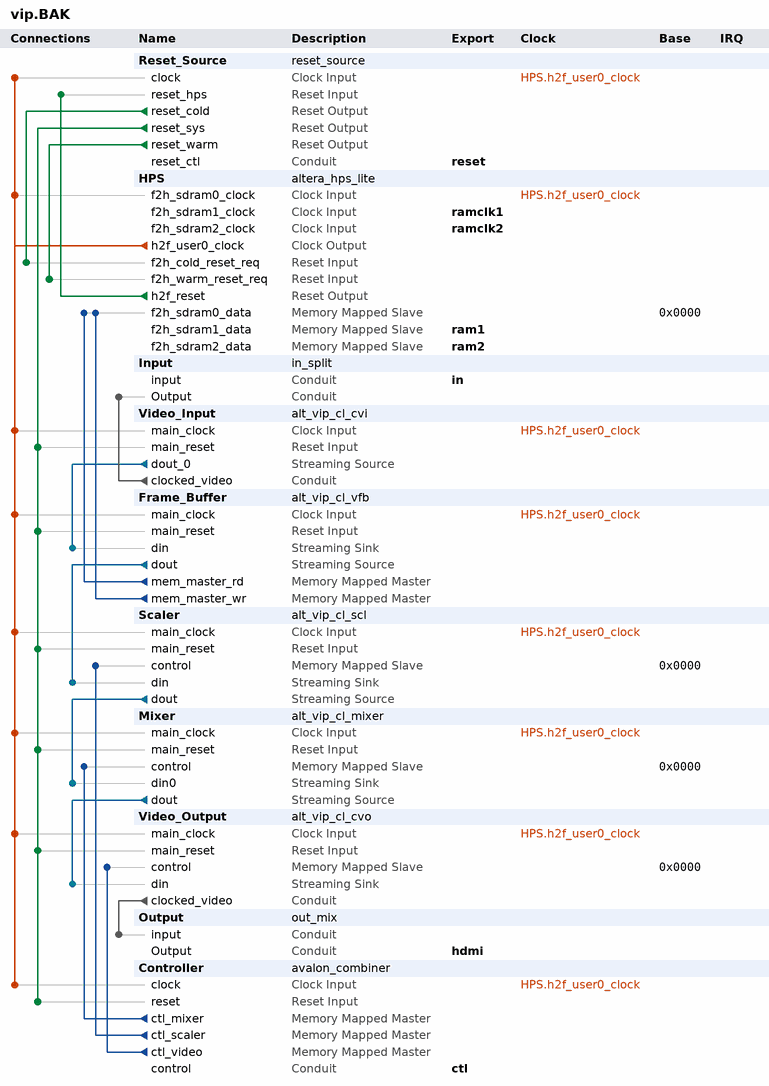
[diagram p0: system contents]
# Platform Designer (Qsys) system vip.BAK, Cyclone V 5CSEBA6U23I7
# Parameters at their usual value, and those the tool derives, are not listed.
package require -exact qsys 17.0
create_system vip.BAK
set_project_property DEVICE_FAMILY {Cyclone V}
set_project_property DEVICE 5CSEBA6U23I7

add_instance Reset_Source reset_source 17.0

add_instance HPS altera_hps_lite 17.0
set_instance_parameter_value HPS BONDING_OUT_ENABLED false
set_instance_parameter_value HPS BOOTFROMFPGA_Enable false
set_instance_parameter_value HPS BSEL 1
set_instance_parameter_value HPS BSEL_EN false
set_instance_parameter_value HPS CAN0_Mode N/A
set_instance_parameter_value HPS CAN0_PinMuxing Unused
set_instance_parameter_value HPS CAN1_Mode N/A
set_instance_parameter_value HPS CAN1_PinMuxing Unused
set_instance_parameter_value HPS CSEL 0
set_instance_parameter_value HPS CSEL_EN false
set_instance_parameter_value HPS CTI_Enable false
set_instance_parameter_value HPS DEBUGAPB_Enable false
set_instance_parameter_value HPS DMA_Enable No,No,No,No,No,No,No,No
set_instance_parameter_value HPS EMAC0_Mode N/A
set_instance_parameter_value HPS EMAC0_PTP false
set_instance_parameter_value HPS EMAC0_PinMuxing Unused
set_instance_parameter_value HPS EMAC1_Mode N/A
set_instance_parameter_value HPS EMAC1_PTP false
set_instance_parameter_value HPS EMAC1_PinMuxing Unused
set_instance_parameter_value HPS F2H_AXI_CLOCK_FREQ 100
set_instance_parameter_value HPS F2H_SDRAM0_CLOCK_FREQ 100000000
set_instance_parameter_value HPS F2H_SDRAM1_CLOCK_FREQ 0
set_instance_parameter_value HPS F2H_SDRAM2_CLOCK_FREQ 0
set_instance_parameter_value HPS F2H_SDRAM3_CLOCK_FREQ 100
set_instance_parameter_value HPS F2H_SDRAM4_CLOCK_FREQ 100
set_instance_parameter_value HPS F2H_SDRAM5_CLOCK_FREQ 100
set_instance_parameter_value HPS F2SCLK_COLDRST_Enable true
set_instance_parameter_value HPS F2SCLK_DBGRST_Enable false
set_instance_parameter_value HPS F2SCLK_PERIPHCLK_Enable false
set_instance_parameter_value HPS F2SCLK_PERIPHCLK_FREQ 0
set_instance_parameter_value HPS F2SCLK_SDRAMCLK_Enable false
set_instance_parameter_value HPS F2SCLK_SDRAMCLK_FREQ 0
set_instance_parameter_value HPS F2SCLK_WARMRST_Enable true
set_instance_parameter_value HPS F2SDRAM_Type {Avalon-MM Bidirectional,Avalon-MM Bidirectional,Avalon-MM Bidirectional}
set_instance_parameter_value HPS F2SDRAM_Width 128,64,64
set_instance_parameter_value HPS F2SINTERRUPT_Enable false
set_instance_parameter_value HPS F2S_Width 0
set_instance_parameter_value HPS FPGA_PERIPHERAL_INPUT_CLOCK_FREQ_EMAC0_RX_CLK_IN 100
set_instance_parameter_value HPS FPGA_PERIPHERAL_INPUT_CLOCK_FREQ_EMAC0_TX_CLK_IN 100
set_instance_parameter_value HPS FPGA_PERIPHERAL_INPUT_CLOCK_FREQ_EMAC1_RX_CLK_IN 100
set_instance_parameter_value HPS FPGA_PERIPHERAL_INPUT_CLOCK_FREQ_EMAC1_TX_CLK_IN 100
set_instance_parameter_value HPS FPGA_PERIPHERAL_INPUT_CLOCK_FREQ_EMAC_PTP_REF_CLOCK 100
set_instance_parameter_value HPS FPGA_PERIPHERAL_INPUT_CLOCK_FREQ_I2C0_SCL_IN 100
set_instance_parameter_value HPS FPGA_PERIPHERAL_INPUT_CLOCK_FREQ_I2C1_SCL_IN 100
set_instance_parameter_value HPS FPGA_PERIPHERAL_INPUT_CLOCK_FREQ_I2C2_SCL_IN 100
set_instance_parameter_value HPS FPGA_PERIPHERAL_INPUT_CLOCK_FREQ_I2C3_SCL_IN 100
set_instance_parameter_value HPS FPGA_PERIPHERAL_INPUT_CLOCK_FREQ_SPIS0_SCLK_IN 100
set_instance_parameter_value HPS FPGA_PERIPHERAL_INPUT_CLOCK_FREQ_SPIS1_SCLK_IN 100
set_instance_parameter_value HPS FPGA_PERIPHERAL_INPUT_CLOCK_FREQ_USB0_CLK_IN 100
set_instance_parameter_value HPS FPGA_PERIPHERAL_INPUT_CLOCK_FREQ_USB1_CLK_IN 100
set_instance_parameter_value HPS FPGA_PERIPHERAL_OUTPUT_CLOCK_FREQ_EMAC0_GTX_CLK 125
set_instance_parameter_value HPS FPGA_PERIPHERAL_OUTPUT_CLOCK_FREQ_EMAC0_MD_CLK 2.5
set_instance_parameter_value HPS FPGA_PERIPHERAL_OUTPUT_CLOCK_FREQ_EMAC1_GTX_CLK 125
set_instance_parameter_value HPS FPGA_PERIPHERAL_OUTPUT_CLOCK_FREQ_EMAC1_MD_CLK 2.5
set_instance_parameter_value HPS FPGA_PERIPHERAL_OUTPUT_CLOCK_FREQ_I2C0_CLK 100
set_instance_parameter_value HPS FPGA_PERIPHERAL_OUTPUT_CLOCK_FREQ_I2C1_CLK 100
set_instance_parameter_value HPS FPGA_PERIPHERAL_OUTPUT_CLOCK_FREQ_I2C2_CLK 100
set_instance_parameter_value HPS FPGA_PERIPHERAL_OUTPUT_CLOCK_FREQ_I2C3_CLK 100
set_instance_parameter_value HPS FPGA_PERIPHERAL_OUTPUT_CLOCK_FREQ_QSPI_SCLK_OUT 100
set_instance_parameter_value HPS FPGA_PERIPHERAL_OUTPUT_CLOCK_FREQ_SDIO_CCLK 100
set_instance_parameter_value HPS FPGA_PERIPHERAL_OUTPUT_CLOCK_FREQ_SPIM0_SCLK_OUT 100
set_instance_parameter_value HPS FPGA_PERIPHERAL_OUTPUT_CLOCK_FREQ_SPIM1_SCLK_OUT 100
set_instance_parameter_value HPS GPIO_Enable No,No,No,No,No,No,No,No,No,No,No,No,No,No,No,No,No,No,No,No,No,No,No,No,No,No,No,No,No,No,No,No,No,No,No,No,No,No,No,No,No,No,No,No,No,No,No,No,No,No,No,No,No,No,No,No,No,No,No,No,No,No,No,No,No,No,No,No,No,No,No,No,No,No,No,No,No,No,No,No,No,No,No,No,No,No,No,No,No,No,No,No,No,No,No,No,No,No,No,No
set_instance_parameter_value HPS GP_Enable false
set_instance_parameter_value HPS H2F_AXI_CLOCK_FREQ 100
set_instance_parameter_value HPS H2F_CTI_CLOCK_FREQ 100
set_instance_parameter_value HPS H2F_DEBUG_APB_CLOCK_FREQ 100
set_instance_parameter_value HPS H2F_LW_AXI_CLOCK_FREQ 100
set_instance_parameter_value HPS H2F_TPIU_CLOCK_IN_FREQ 100
set_instance_parameter_value HPS HLGPI_Enable false
set_instance_parameter_value HPS I2C0_Mode N/A
set_instance_parameter_value HPS I2C0_PinMuxing Unused
set_instance_parameter_value HPS I2C1_Mode N/A
set_instance_parameter_value HPS I2C1_PinMuxing Unused
set_instance_parameter_value HPS I2C2_Mode N/A
set_instance_parameter_value HPS I2C2_PinMuxing Unused
set_instance_parameter_value HPS I2C3_Mode N/A
set_instance_parameter_value HPS I2C3_PinMuxing Unused
set_instance_parameter_value HPS LOANIO_Enable No,No,No,No,No,No,No,No,No,No,No,No,No,No,No,No,No,No,No,No,No,No,No,No,No,No,No,No,No,No,No,No,No,No,No,No,No,No,No,No,No,No,No,No,No,No,No,No,No,No,No,No,No,No,No,No,No,No,No,No,No,No,No,No,No,No,No,No,No,No,No,No,No,No,No,No,No,No,No,No,No,No,No,No,No,No,No,No,No,No,No,No,No,No,No,No,No,No,No,No
set_instance_parameter_value HPS LWH2F_Enable false
set_instance_parameter_value HPS MPU_EVENTS_Enable false
set_instance_parameter_value HPS NAND_Mode N/A
set_instance_parameter_value HPS NAND_PinMuxing Unused
set_instance_parameter_value HPS QSPI_Mode N/A
set_instance_parameter_value HPS QSPI_PinMuxing Unused
set_instance_parameter_value HPS S2FCLK_COLDRST_Enable false
set_instance_parameter_value HPS S2FCLK_PENDINGRST_Enable false
set_instance_parameter_value HPS S2FCLK_USER0CLK_Enable true
set_instance_parameter_value HPS S2FCLK_USER1CLK_Enable false
set_instance_parameter_value HPS S2FCLK_USER1CLK_FREQ 100.0
set_instance_parameter_value HPS S2FCLK_USER2CLK 5
set_instance_parameter_value HPS S2FCLK_USER2CLK_Enable false
set_instance_parameter_value HPS S2FCLK_USER2CLK_FREQ 100.0
set_instance_parameter_value HPS S2FINTERRUPT_CAN_Enable false
set_instance_parameter_value HPS S2FINTERRUPT_CLOCKPERIPHERAL_Enable false
set_instance_parameter_value HPS S2FINTERRUPT_CTI_Enable false
set_instance_parameter_value HPS S2FINTERRUPT_DMA_Enable false
set_instance_parameter_value HPS S2FINTERRUPT_EMAC_Enable false
set_instance_parameter_value HPS S2FINTERRUPT_FPGAMANAGER_Enable false
set_instance_parameter_value HPS S2FINTERRUPT_GPIO_Enable false
set_instance_parameter_value HPS S2FINTERRUPT_I2CEMAC_Enable false
set_instance_parameter_value HPS S2FINTERRUPT_I2CPERIPHERAL_Enable false
set_instance_parameter_value HPS S2FINTERRUPT_L4TIMER_Enable false
set_instance_parameter_value HPS S2FINTERRUPT_NAND_Enable false
set_instance_parameter_value HPS S2FINTERRUPT_OSCTIMER_Enable false
set_instance_parameter_value HPS S2FINTERRUPT_QSPI_Enable false
set_instance_parameter_value HPS S2FINTERRUPT_SDMMC_Enable false
set_instance_parameter_value HPS S2FINTERRUPT_SPIMASTER_Enable false
set_instance_parameter_value HPS S2FINTERRUPT_SPISLAVE_Enable false
set_instance_parameter_value HPS S2FINTERRUPT_UART_Enable false
set_instance_parameter_value HPS S2FINTERRUPT_USB_Enable false
set_instance_parameter_value HPS S2FINTERRUPT_WATCHDOG_Enable false
set_instance_parameter_value HPS S2F_Width 0
set_instance_parameter_value HPS SDIO_Mode N/A
set_instance_parameter_value HPS SDIO_PinMuxing Unused
set_instance_parameter_value HPS SPIM0_Mode N/A
set_instance_parameter_value HPS SPIM0_PinMuxing Unused
set_instance_parameter_value HPS SPIM1_Mode N/A
set_instance_parameter_value HPS SPIM1_PinMuxing Unused
set_instance_parameter_value HPS SPIS0_Mode N/A
set_instance_parameter_value HPS SPIS0_PinMuxing Unused
set_instance_parameter_value HPS SPIS1_Mode N/A
set_instance_parameter_value HPS SPIS1_PinMuxing Unused
set_instance_parameter_value HPS STM_Enable false
set_instance_parameter_value HPS TEST_Enable false
set_instance_parameter_value HPS TPIUFPGA_Enable false
set_instance_parameter_value HPS TPIUFPGA_alt false
set_instance_parameter_value HPS TRACE_Mode N/A
set_instance_parameter_value HPS TRACE_PinMuxing Unused
set_instance_parameter_value HPS UART0_Mode N/A
set_instance_parameter_value HPS UART0_PinMuxing Unused
set_instance_parameter_value HPS UART1_Mode N/A
set_instance_parameter_value HPS UART1_PinMuxing Unused
set_instance_parameter_value HPS USB0_Mode N/A
set_instance_parameter_value HPS USB0_PinMuxing Unused
set_instance_parameter_value HPS USB1_Mode N/A
set_instance_parameter_value HPS USB1_PinMuxing Unused
set_instance_parameter_value HPS can0_clk_div 1
set_instance_parameter_value HPS can1_clk_div 1
set_instance_parameter_value HPS configure_advanced_parameters false
set_instance_parameter_value HPS customize_device_pll_info false
set_instance_parameter_value HPS dbctrl_stayosc1 true
set_instance_parameter_value HPS dbg_at_clk_div 0
set_instance_parameter_value HPS dbg_clk_div 1
set_instance_parameter_value HPS dbg_trace_clk_div 0
set_instance_parameter_value HPS desired_can0_clk_mhz 100.0
set_instance_parameter_value HPS desired_can1_clk_mhz 100.0
set_instance_parameter_value HPS desired_cfg_clk_mhz 100.0
set_instance_parameter_value HPS desired_emac0_clk_mhz 250.0
set_instance_parameter_value HPS desired_emac1_clk_mhz 250.0
set_instance_parameter_value HPS desired_gpio_db_clk_hz 32000
set_instance_parameter_value HPS desired_l4_mp_clk_mhz 100.0
set_instance_parameter_value HPS desired_l4_sp_clk_mhz 100.0
set_instance_parameter_value HPS desired_mpu_clk_mhz 800.0
set_instance_parameter_value HPS desired_nand_clk_mhz 12.5
set_instance_parameter_value HPS desired_qspi_clk_mhz 400.0
set_instance_parameter_value HPS desired_sdmmc_clk_mhz 200.0
set_instance_parameter_value HPS desired_spi_m_clk_mhz 200.0
set_instance_parameter_value HPS desired_usb_mp_clk_mhz 200.0
set_instance_parameter_value HPS device_name 5CSEBA6U23I7
set_instance_parameter_value HPS device_pll_info_manual {{320000000 1600000000} {320000000 1000000000} {800000000 400000000 400000000}}
set_instance_parameter_value HPS eosc1_clk_mhz 25.0
set_instance_parameter_value HPS eosc2_clk_mhz 25.0
set_instance_parameter_value HPS gpio_db_clk_div 6249
set_instance_parameter_value HPS l3_mp_clk_div 1
set_instance_parameter_value HPS l3_sp_clk_div 1
set_instance_parameter_value HPS l4_mp_clk_div 1
set_instance_parameter_value HPS l4_mp_clk_source 1
set_instance_parameter_value HPS l4_sp_clk_div 1
set_instance_parameter_value HPS l4_sp_clk_source 1
set_instance_parameter_value HPS main_pll_c3 3
set_instance_parameter_value HPS main_pll_c4 3
set_instance_parameter_value HPS main_pll_c5 15
set_instance_parameter_value HPS main_pll_m 63
set_instance_parameter_value HPS main_pll_n 0
set_instance_parameter_value HPS nand_clk_source 2
set_instance_parameter_value HPS periph_pll_c0 3
set_instance_parameter_value HPS periph_pll_c1 3
set_instance_parameter_value HPS periph_pll_c2 1
set_instance_parameter_value HPS periph_pll_c3 19
set_instance_parameter_value HPS periph_pll_c4 4
set_instance_parameter_value HPS periph_pll_c5 9
set_instance_parameter_value HPS periph_pll_m 79
set_instance_parameter_value HPS periph_pll_n 1
set_instance_parameter_value HPS periph_pll_source 0
set_instance_parameter_value HPS qspi_clk_source 1
set_instance_parameter_value HPS quartus_ini_hps_emif_pll false
set_instance_parameter_value HPS quartus_ini_hps_ip_enable_all_peripheral_fpga_interfaces false
set_instance_parameter_value HPS quartus_ini_hps_ip_enable_bsel_csel false
set_instance_parameter_value HPS quartus_ini_hps_ip_enable_emac0_peripheral_fpga_interface false
set_instance_parameter_value HPS quartus_ini_hps_ip_enable_low_speed_serial_fpga_interfaces false
set_instance_parameter_value HPS quartus_ini_hps_ip_enable_test_interface false
set_instance_parameter_value HPS quartus_ini_hps_ip_f2sdram_bonding_out false
set_instance_parameter_value HPS quartus_ini_hps_ip_fast_f2sdram_sim_model false
set_instance_parameter_value HPS quartus_ini_hps_ip_suppress_sdram_synth false
set_instance_parameter_value HPS sdmmc_clk_source 2
set_instance_parameter_value HPS show_advanced_parameters false
set_instance_parameter_value HPS show_debug_info_as_warning_msg false
set_instance_parameter_value HPS show_warning_as_error_msg false
set_instance_parameter_value HPS spi_m_clk_div 0
set_instance_parameter_value HPS usb_mp_clk_div 0
set_instance_parameter_value HPS use_default_mpu_clk true

add_instance Input in_split 17.0

add_instance Video_Input alt_vip_cl_cvi 17.1
set_instance_parameter_value Video_Input ACCEPT_COLOURS_IN_SEQ 0
set_instance_parameter_value Video_Input ANC_DEPTH 1
set_instance_parameter_value Video_Input BPS 8
set_instance_parameter_value Video_Input CLOCKS_ARE_SAME 0
set_instance_parameter_value Video_Input COLOUR_PLANES_ARE_IN_PARALLEL 1
set_instance_parameter_value Video_Input EXTRACT_TOTAL_RESOLUTION 1
set_instance_parameter_value Video_Input FIFO_DEPTH 2048
set_instance_parameter_value Video_Input GENERATE_ANC 0
set_instance_parameter_value Video_Input GENERATE_VID_F 0
set_instance_parameter_value Video_Input H_ACTIVE_PIXELS_F0 1920
set_instance_parameter_value Video_Input INTERLACED 0
set_instance_parameter_value Video_Input MATCH_CTRLDATA_PKT_CLIP_BASIC 0
set_instance_parameter_value Video_Input MATCH_CTRLDATA_PKT_PAD_ADV 0
set_instance_parameter_value Video_Input NO_OF_CHANNELS 1
set_instance_parameter_value Video_Input NUMBER_OF_COLOUR_PLANES 3
set_instance_parameter_value Video_Input OVERFLOW_HANDLING 0
set_instance_parameter_value Video_Input PIXELS_IN_PARALLEL 2
set_instance_parameter_value Video_Input STD_WIDTH 1
set_instance_parameter_value Video_Input SYNC_TO 2
set_instance_parameter_value Video_Input USE_CONTROL 0
set_instance_parameter_value Video_Input USE_EMBEDDED_SYNCS 0
set_instance_parameter_value Video_Input USE_HDMI_DEPRICATION 0
set_instance_parameter_value Video_Input USE_STD 0
set_instance_parameter_value Video_Input V_ACTIVE_LINES_F0 1080
set_instance_parameter_value Video_Input V_ACTIVE_LINES_F1 480

add_instance Frame_Buffer alt_vip_cl_vfb 17.1
set_instance_parameter_value Frame_Buffer CLOCKS_ARE_SEPARATE 0
set_instance_parameter_value Frame_Buffer DROP_FRAMES 1
set_instance_parameter_value Frame_Buffer DROP_INVALID_FIELDS 1
set_instance_parameter_value Frame_Buffer DROP_REPEAT_USER 0
set_instance_parameter_value Frame_Buffer IS_FRAME_READER 0
set_instance_parameter_value Frame_Buffer LINE_BASED_BUFFERING 0
set_instance_parameter_value Frame_Buffer MAX_HEIGHT 1080
set_instance_parameter_value Frame_Buffer MAX_WIDTH 1920
set_instance_parameter_value Frame_Buffer MEM_BASE_ADDR 536870912
set_instance_parameter_value Frame_Buffer MEM_BUFFER_OFFSET 16777216
set_instance_parameter_value Frame_Buffer MEM_PORT_WIDTH 128
set_instance_parameter_value Frame_Buffer PIXELS_IN_PARALLEL 2
set_instance_parameter_value Frame_Buffer READER_RUNTIME_CONTROL 0
set_instance_parameter_value Frame_Buffer READ_BURST_TARGET 64
set_instance_parameter_value Frame_Buffer READ_FIFO_DEPTH 512
set_instance_parameter_value Frame_Buffer USER_PACKETS_MAX_STORAGE 1
set_instance_parameter_value Frame_Buffer USE_BUFFER_OFFSET 0
set_instance_parameter_value Frame_Buffer WRITE_BURST_TARGET 64
set_instance_parameter_value Frame_Buffer WRITE_FIFO_DEPTH 512

add_instance Scaler alt_vip_cl_scl 17.1
set_instance_parameter_value Scaler ALGORITHM_NAME POLYPHASE
set_instance_parameter_value Scaler ALWAYS_DOWNSCALE 0
set_instance_parameter_value Scaler ARE_IDENTICAL 1
set_instance_parameter_value Scaler BITS_PER_SYMBOL 8
set_instance_parameter_value Scaler DEFAULT_EDGE_THRESH 7
set_instance_parameter_value Scaler DEFAULT_LOWER_BLUR 0
set_instance_parameter_value Scaler DEFAULT_UPPER_BLUR 0
set_instance_parameter_value Scaler ENABLE_FIR 0
set_instance_parameter_value Scaler EXTRA_PIPELINING 1
set_instance_parameter_value Scaler FAMILY {Cyclone V}
set_instance_parameter_value Scaler H_BANKS 1
set_instance_parameter_value Scaler H_COEFF_FILE {<enter file name (including full path)>}
set_instance_parameter_value Scaler H_FRACTION_BITS 7
set_instance_parameter_value Scaler H_FUNCTION LANCZOS_3
set_instance_parameter_value Scaler H_INTEGER_BITS 1
set_instance_parameter_value Scaler H_PHASES 16
set_instance_parameter_value Scaler H_SIGNED 1
set_instance_parameter_value Scaler H_SYMMETRIC 0
set_instance_parameter_value Scaler H_TAPS 4
set_instance_parameter_value Scaler IS_420 0
set_instance_parameter_value Scaler IS_422 0
set_instance_parameter_value Scaler LIMITED_READBACK 0
set_instance_parameter_value Scaler LOAD_AT_RUNTIME 0
set_instance_parameter_value Scaler MAX_IN_HEIGHT 1080
set_instance_parameter_value Scaler MAX_IN_WIDTH 1920
set_instance_parameter_value Scaler MAX_OUT_HEIGHT 1080
set_instance_parameter_value Scaler MAX_OUT_WIDTH 1920
set_instance_parameter_value Scaler NO_BLANKING 0
set_instance_parameter_value Scaler PIXELS_IN_PARALLEL 2
set_instance_parameter_value Scaler PRESERVE_BITS 0
set_instance_parameter_value Scaler RUNTIME_CONTROL 1
set_instance_parameter_value Scaler SYMBOLS_IN_PAR 3
set_instance_parameter_value Scaler SYMBOLS_IN_SEQ 1
set_instance_parameter_value Scaler USER_PACKET_FIFO_DEPTH 0
set_instance_parameter_value Scaler USER_PACKET_SUPPORT PASSTHROUGH
set_instance_parameter_value Scaler V_BANKS 1
set_instance_parameter_value Scaler V_COEFF_FILE {<enter file name (including full path)>}
set_instance_parameter_value Scaler V_FRACTION_BITS 7
set_instance_parameter_value Scaler V_FUNCTION LANCZOS_2
set_instance_parameter_value Scaler V_INTEGER_BITS 1
set_instance_parameter_value Scaler V_PHASES 32
set_instance_parameter_value Scaler V_SIGNED 1
set_instance_parameter_value Scaler V_SYMMETRIC 0
set_instance_parameter_value Scaler V_TAPS 4

add_instance Mixer alt_vip_cl_mixer 17.1
set_instance_parameter_value Mixer ALPHA_ENABLE 0
set_instance_parameter_value Mixer ALPHA_STREAMS_ENABLE 0
set_instance_parameter_value Mixer BITS_PER_SYMBOL 8
set_instance_parameter_value Mixer COLOR_PLANES_ARE_IN_PARALLEL 1
set_instance_parameter_value Mixer COLOR_SPACE RGB
set_instance_parameter_value Mixer FAMILY {Cyclone V}
set_instance_parameter_value Mixer IS_422 1
set_instance_parameter_value Mixer LAYER_POSITION_ENABLE 0
set_instance_parameter_value Mixer MAX_HEIGHT 1080
set_instance_parameter_value Mixer MAX_WIDTH 1920
set_instance_parameter_value Mixer NO_OF_INPUTS 1
set_instance_parameter_value Mixer NUMBER_OF_COLOR_PLANES 2
set_instance_parameter_value Mixer PATTERN uniform
set_instance_parameter_value Mixer PIPELINE_READY 0
set_instance_parameter_value Mixer PIXELS_IN_PARALLEL 2
set_instance_parameter_value Mixer UNIFORM_VALUE_BCR 0
set_instance_parameter_value Mixer UNIFORM_VALUE_GCB 0
set_instance_parameter_value Mixer UNIFORM_VALUE_RY 0
set_instance_parameter_value Mixer USER_PACKET_FIFO_DEPTH 0
set_instance_parameter_value Mixer USER_PACKET_SUPPORT DISCARD

add_instance Video_Output alt_vip_cl_cvo 17.1
set_instance_parameter_value Video_Output ACCEPT_COLOURS_IN_SEQ 0
set_instance_parameter_value Video_Output ACCEPT_SYNC 0
set_instance_parameter_value Video_Output ANC_LINE 0
set_instance_parameter_value Video_Output AP_LINE 0
set_instance_parameter_value Video_Output BPS 8
set_instance_parameter_value Video_Output CLOCKS_ARE_SAME 0
set_instance_parameter_value Video_Output COLOUR_PLANES_ARE_IN_PARALLEL 1
set_instance_parameter_value Video_Output CONTEXT_WIDTH 8
set_instance_parameter_value Video_Output COUNT_STEP_IS_PIP_VALUE 0
set_instance_parameter_value Video_Output DST_WIDTH 8
set_instance_parameter_value Video_Output FIELD0_ANC_LINE 0
set_instance_parameter_value Video_Output FIELD0_V_BACK_PORCH 0
set_instance_parameter_value Video_Output FIELD0_V_BLANK 0
set_instance_parameter_value Video_Output FIELD0_V_FRONT_PORCH 0
set_instance_parameter_value Video_Output FIELD0_V_RISING_EDGE 0
set_instance_parameter_value Video_Output FIELD0_V_SYNC_LENGTH 0
set_instance_parameter_value Video_Output FIFO_DEPTH 2000
set_instance_parameter_value Video_Output F_FALLING_EDGE 0
set_instance_parameter_value Video_Output F_RISING_EDGE 0
set_instance_parameter_value Video_Output GENERATE_SYNC 0
set_instance_parameter_value Video_Output H_ACTIVE_PIXELS 1920
set_instance_parameter_value Video_Output H_BACK_PORCH 148
set_instance_parameter_value Video_Output H_BLANK 0
set_instance_parameter_value Video_Output H_FRONT_PORCH 88
set_instance_parameter_value Video_Output H_SYNC_LENGTH 44
set_instance_parameter_value Video_Output INTERLACED 0
set_instance_parameter_value Video_Output LOW_LATENCY 1
set_instance_parameter_value Video_Output NO_OF_CHANNELS 1
set_instance_parameter_value Video_Output NO_OF_MODES 1
set_instance_parameter_value Video_Output NUMBER_OF_COLOUR_PLANES 3
set_instance_parameter_value Video_Output PIXELS_IN_PARALLEL 2
set_instance_parameter_value Video_Output SRC_WIDTH 8
set_instance_parameter_value Video_Output STD_WIDTH 1
set_instance_parameter_value Video_Output TASK_WIDTH 8
set_instance_parameter_value Video_Output THRESHOLD 1999
set_instance_parameter_value Video_Output USE_CONTROL 1
set_instance_parameter_value Video_Output USE_EMBEDDED_SYNCS 0
set_instance_parameter_value Video_Output V_ACTIVE_LINES 1080
set_instance_parameter_value Video_Output V_BACK_PORCH 15
set_instance_parameter_value Video_Output V_BLANK 0
set_instance_parameter_value Video_Output V_FRONT_PORCH 2
set_instance_parameter_value Video_Output V_SYNC_LENGTH 5

add_instance Output out_mix 17.0

add_instance Controller avalon_combiner 17.0

# connections
add_connection HPS.h2f_user0_clock Controller.clock clock
add_connection HPS.h2f_user0_clock Frame_Buffer.main_clock clock
add_connection HPS.h2f_user0_clock HPS.f2h_sdram0_clock clock
add_connection HPS.h2f_user0_clock Mixer.main_clock clock
add_connection HPS.h2f_user0_clock Reset_Source.clock clock
add_connection HPS.h2f_user0_clock Scaler.main_clock clock
add_connection HPS.h2f_user0_clock Video_Input.main_clock clock
add_connection HPS.h2f_user0_clock Video_Output.main_clock clock
add_connection HPS.h2f_reset Reset_Source.reset_hps reset
add_connection Reset_Source.reset_cold HPS.f2h_cold_reset_req reset
add_connection Reset_Source.reset_sys Controller.reset reset
add_connection Reset_Source.reset_sys Frame_Buffer.main_reset reset
add_connection Reset_Source.reset_sys Mixer.main_reset reset
add_connection Reset_Source.reset_sys Scaler.main_reset reset
add_connection Reset_Source.reset_sys Video_Input.main_reset reset
add_connection Reset_Source.reset_sys Video_Output.main_reset reset
add_connection Reset_Source.reset_warm HPS.f2h_warm_reset_req reset
add_connection Controller.ctl_mixer Mixer.control avalon
set_connection_parameter_value Controller.ctl_mixer/Mixer.control baseAddress 0x0000
add_connection Controller.ctl_scaler Scaler.control avalon
set_connection_parameter_value Controller.ctl_scaler/Scaler.control baseAddress 0x0000
add_connection Controller.ctl_video Video_Output.control avalon
set_connection_parameter_value Controller.ctl_video/Video_Output.control baseAddress 0x0000
add_connection Frame_Buffer.mem_master_rd HPS.f2h_sdram0_data avalon
set_connection_parameter_value Frame_Buffer.mem_master_rd/HPS.f2h_sdram0_data baseAddress 0x0000
add_connection Frame_Buffer.mem_master_wr HPS.f2h_sdram0_data avalon
set_connection_parameter_value Frame_Buffer.mem_master_wr/HPS.f2h_sdram0_data baseAddress 0x0000
add_connection Frame_Buffer.dout Scaler.din avalon_streaming
add_connection Mixer.dout Video_Output.din avalon_streaming
add_connection Scaler.dout Mixer.din0 avalon_streaming
add_connection Video_Input.dout_0 Frame_Buffer.din avalon_streaming
add_connection Video_Input.clocked_video Input.Output conduit
add_connection Video_Output.clocked_video Output.input conduit

# exported interfaces
add_interface ctl conduit end
set_interface_property ctl EXPORT_OF Controller.control
add_interface hdmi conduit end
set_interface_property hdmi EXPORT_OF Output.Output
add_interface in conduit end
set_interface_property in EXPORT_OF Input.input
add_interface ram1 avalon slave
set_interface_property ram1 EXPORT_OF HPS.f2h_sdram1_data
add_interface ram2 avalon slave
set_interface_property ram2 EXPORT_OF HPS.f2h_sdram2_data
add_interface ramclk1 clock sink
set_interface_property ramclk1 EXPORT_OF HPS.f2h_sdram1_clock
add_interface ramclk2 clock sink
set_interface_property ramclk2 EXPORT_OF HPS.f2h_sdram2_clock
add_interface reset conduit end
set_interface_property reset EXPORT_OF Reset_Source.reset_ctl

set_interconnect_requirement {$system} qsys_mm.clockCrossingAdapter HANDSHAKE
set_interconnect_requirement {$system} qsys_mm.maxAdditionalLatency 1

save_system vip.BAK.qsys
